# Altium schematic sheet Top_Level_Block Diagram.SchDoc
size A4
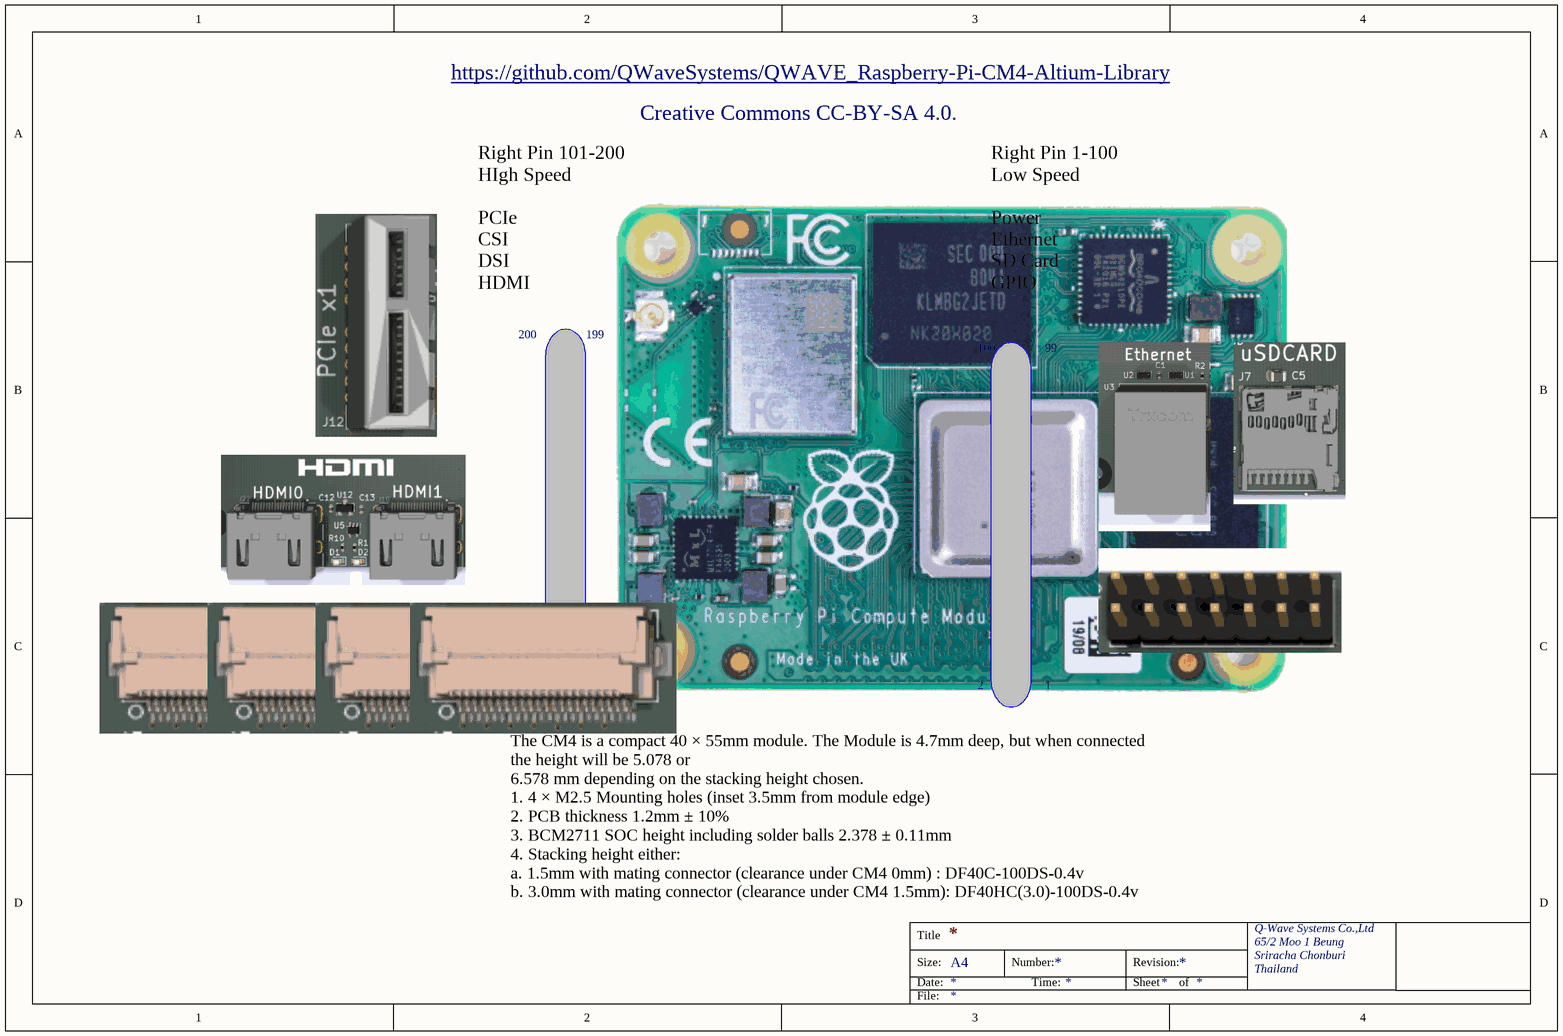
[diagram p0: Top_Level_Block Diagram.SchDoc]

## Notes on the sheet
- https://github.com/QWaveSystems/QWAVE_Raspberry-Pi-CM4-Altium-Library
- Creative Commons CC-BY-SA 4.0.
- Right Pin 101-200
  HIgh Speed
  PCIe
  CSI
  DSI
  HDMI
- Right Pin 1-100
  Low Speed
  Power
  Ethernet
  SD Card
  GPIO
- 200
- 199
- 100
- 99
- 102
- 101
- 2
- 1
- The CM4 is a compact 40 × 55mm module. The Module is 4.7mm deep, but when connected the height will be 5.078 or
  6.578 mm depending on the stacking height chosen.
  1. 4 × M2.5 Mounting holes (inset 3.5mm from module edge)
  2. PCB thickness 1.2mm ± 10%
  3. BCM2711 SOC height including solder balls 2.378 ± 0.11mm
  4. Stacking height either:
  a. 1.5mm with mating connector (clearance under CM4 0mm) : DF40C-100DS-0.4v
  b. 3.0mm with mating connector (clearance under CM4 1.5mm): DF40HC(3.0)-100DS-0.4v
- Title
- Size:
- Date:
- A4
- Number:
- Time:
- Revision:
- Sheet
- of
- Q-Wave Systems Co.,Ltd
- 65/2 Moo 1 Beung
- Sriracha Chonburi
- Thailand
- File: